# Altium schematic sheet LCD.SchDoc
size C
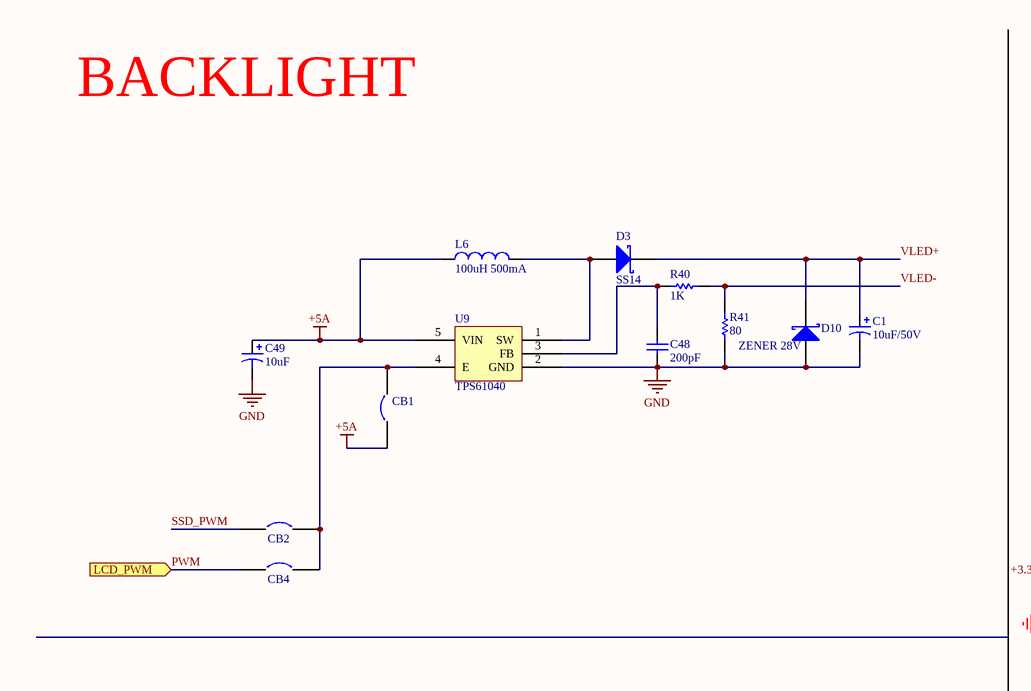
[diagram p0: LCD.SchDoc, left]
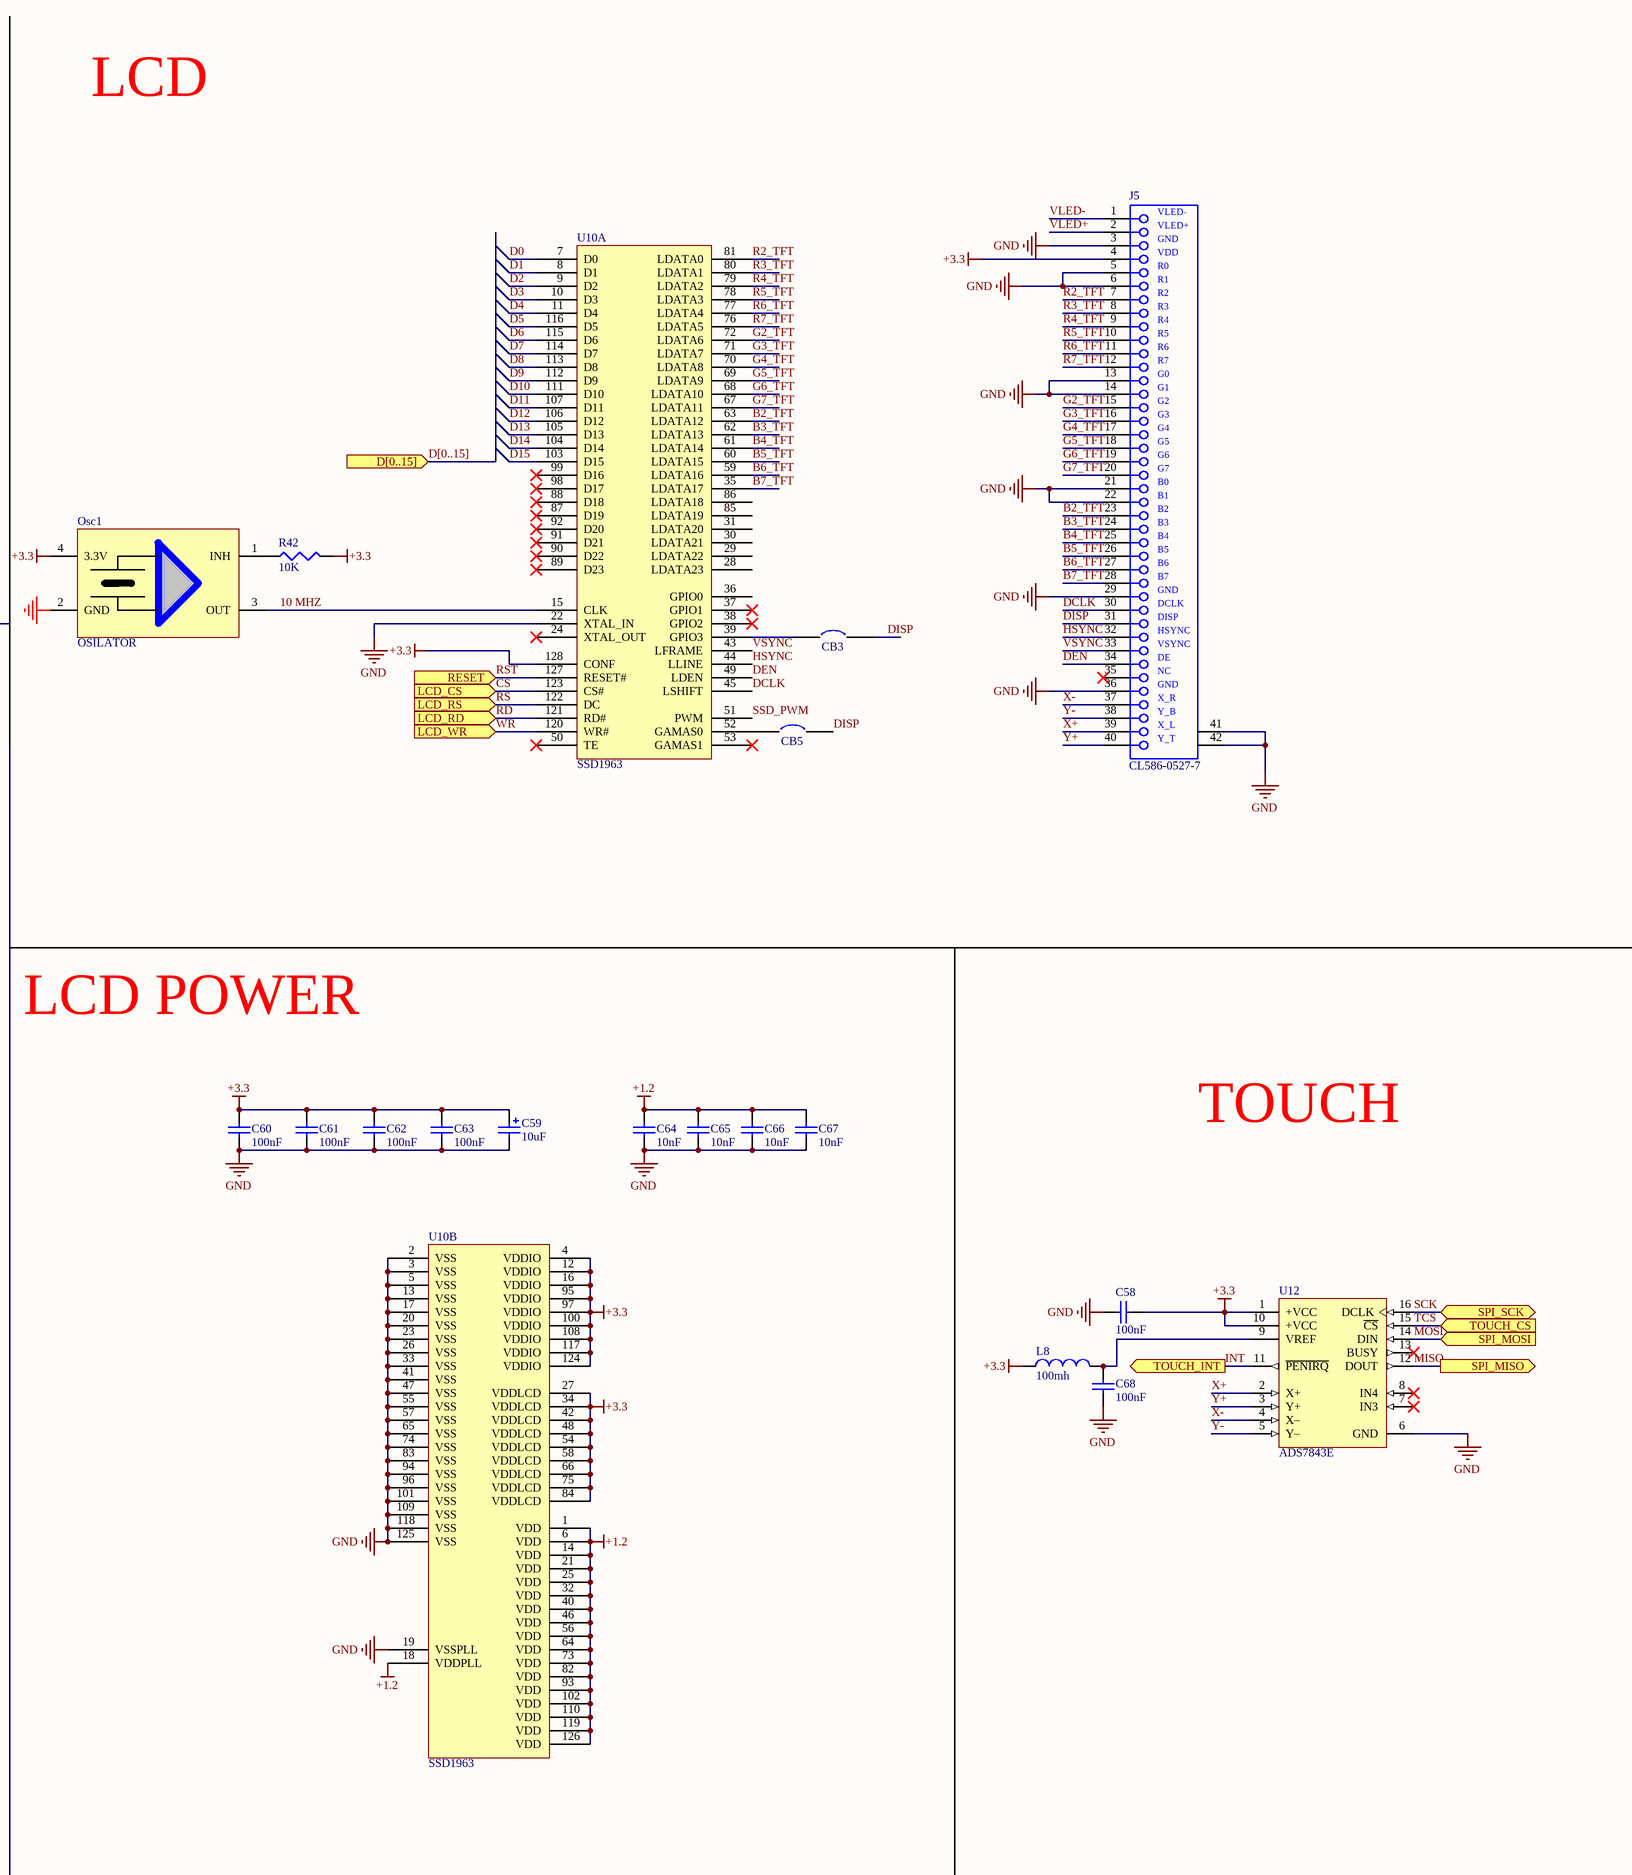
[diagram p1: LCD.SchDoc, right]

## Parts
C1  10uF/50V  [CAP1050]
C48  200pF  [1206]
C49  10uF  [CAP1016]
C58  100nF  [1206]
C59  10uF  [CAP1016]
C60  100nF  [0805]
C61  100nF  [0805]
C62  100nF  [0805]
C63  100nF  [0805]
C64  10nF  [0805]
C65  10nF  [0805]
C66  10nF  [0805]
C67  10nF  [0805]
C68  100nF  [1206]
CB1  JUMPER  [0805]  (value not drawn)
CB2  JUMPER  [0805]  (value not drawn)
CB3  JUMPER  [0805]  (value not drawn)
CB4  JUMPER  [0805]  (value not drawn)
CB5  JUMPER  [0805]  (value not drawn)
D3  SS14  [1N4007]
D10  ZENER 28V  [1N4007]
J5  CL586-0527-7  [FH40SB]
L6  100uH 500mA  [Inductorsmd]
L8  100mh  [L1206]
Osc1  OSILATOR  [XTAL_5X7]
R40  1K  [1206]
R41  80  [1206]
R42  10K  [1206]
U9  TPS61040  [SOT-23-5L]
U10  SSD1963  [LQFP128_M]  (parts A,B of 2)
U12  ADS7843E  [DBQ016]

## Ports
D[0..15] (in), LCD_CS (in), LCD_PWM (in), LCD_RD (in), LCD_RS (in), LCD_WR (in), RESET (in), SPI_MISO (out), SPI_MOSI (in), SPI_SCK (bidir), TOUCH_CS (in), TOUCH_INT (out)

## Nets
+1.2: C64.1 C65.1 C66.1 C67.1 U10.1(VDD) U10.6(VDD) U10.14(VDD) U10.18(VDDPLL) U10.21(VDD) U10.25(VDD) U10.32(VDD) U10.40(VDD) U10.46(VDD) U10.56(VDD) U10.64(VDD) U10.73(VDD) U10.82(VDD) U10.93(VDD) U10.102(VDD) U10.110(VDD) U10.119(VDD) U10.126(VDD)
+3.3: C58.2 C59.1 C60.1 C61.1 C62.1 C63.1 J5.4 L8.1 Osc1.4(3.3V) R42.2 U10.4(VDDIO) U10.12(VDDIO) U10.16(VDDIO) U10.27(VDDLCD) U10.34(VDDLCD) U10.42(VDDLCD) U10.48(VDDLCD) U10.54(VDDLCD) U10.58(VDDLCD) U10.66(VDDLCD) U10.75(VDDLCD) U10.84(VDDLCD) U10.95(VDDIO) U10.97(VDDIO) U10.100(VDDIO) U10.108(VDDIO) U10.117(VDDIO) U10.124(VDDIO) U10.128(CONF) U12.1(+VCC) U12.10(+VCC)
+5A: C49.1 CB1.1 L6.1 U9.5(VIN)
GND: C1.2 C48.1 C49.2 C58.1 C59.2 C60.2 C61.2 C62.2 C63.2 C64.2 C65.2 C66.2 C67.2 C68.1 D10.1(A) J5.3 J5.5 J5.6 J5.13 J5.14 J5.21 J5.22 J5.29 J5.36 J5.41(MH1) J5.42(MH2) Osc1.2(GND) R41.1 U9.2(GND) U10.2(VSS) U10.3(VSS) U10.5(VSS) U10.13(VSS) U10.17(VSS) U10.19(VSSPLL) U10.20(VSS) U10.22(XTAL_IN) U10.23(VSS) U10.26(VSS) U10.33(VSS) U10.41(VSS) U10.47(VSS) U10.55(VSS) U10.57(VSS) U10.65(VSS) U10.74(VSS) U10.83(VSS) U10.94(VSS) U10.96(VSS) U10.101(VSS) U10.109(VSS) U10.118(VSS) U10.125(VSS) U12.6(GND)
10 MHZ: Osc1.3(OUT) U10.15(CLK)
B2_TFT: J5.23 U10.63(LDATA12)
B3_TFT: J5.24 U10.62(LDATA13)
B4_TFT: J5.25 U10.61(LDATA14)
B5_TFT: J5.26 U10.60(LDATA15)
B6_TFT: J5.27 U10.59(LDATA16)
B7_TFT: J5.28 U10.35(LDATA17)
CS: U10.123(CS#) ; port LCD_CS
D0: U10.7(D0)
D1: U10.8(D1)
D2: U10.9(D2)
D3: U10.10(D3)
D4: U10.11(D4)
D5: U10.116(D5)
D6: U10.115(D6)
D7: U10.114(D7)
D8: U10.113(D8)
D9: U10.112(D9)
D10: U10.111(D10)
D11: U10.107(D11)
D12: U10.106(D12)
D13: U10.105(D13)
D14: U10.104(D14)
D15: U10.103(D15)
DCLK: J5.30 U10.45(LSHIFT)
DEN: J5.34 U10.49(LDEN)
DISP: CB3.2 CB5.2 J5.31
G2_TFT: J5.15 U10.72(LDATA6)
G3_TFT: J5.16 U10.71(LDATA7)
G4_TFT: J5.17 U10.70(LDATA8)
G5_TFT: J5.18 U10.69(LDATA9)
G6_TFT: J5.19 U10.68(LDATA10)
G7_TFT: J5.20 U10.67(LDATA11)
HSYNC: J5.32 U10.44(LLINE)
INT: U12.11(~{PENIRQ}) ; port TOUCH_INT
MISO: U12.12(DOUT) ; port SPI_MISO
MOSI: U12.14(DIN) ; port SPI_MOSI
PWM: CB4.1 ; port LCD_PWM
R2_TFT: J5.7 U10.81(LDATA0)
R3_TFT: J5.8 U10.80(LDATA1)
R4_TFT: J5.9 U10.79(LDATA2)
R5_TFT: J5.10 U10.78(LDATA3)
R6_TFT: J5.11 U10.77(LDATA4)
R7_TFT: J5.12 U10.76(LDATA5)
RD: U10.121(RD#) ; port LCD_RD
RS: U10.122(DC) ; port LCD_RS
RST: U10.127(RESET#) ; port RESET
SCK: U12.16(DCLK) ; port SPI_SCK
SSD_PWM: CB2.1 U10.51(PWM)
TCS: U12.15(~{CS}) ; port TOUCH_CS
VLED+: C1.1 D3.2(K) D10.2(K) J5.2
VLED-: J5.1 R40.2 R41.2
VSYNC: J5.33 U10.43(LFRAME)
WR: U10.120(WR#) ; port LCD_WR
X+: J5.39 U12.2(X+)
X-: J5.37 U12.4(X–)
Y+: J5.40 U12.3(Y+)
Y-: J5.38 U12.5(Y–)
NetC48_2: C48.2 R40.1 U9.3(FB)
NetC68_2: C68.2 L8.2 U12.9(VREF)
NetCB1_2: CB1.2 CB2.2 CB4.2 U9.4(E)
NetCB3_1: CB3.1 U10.39(GPIO3)
NetCB5_1: CB5.1 U10.52(GAMAS0)
NetD3_1: D3.1(A) L6.2 U9.1(SW)
NetOsc1_1: Osc1.1(INH) R42.1

Not connected (* = marked no-connect by the designer): J5 35*; U10 24(XTAL_OUT)* 28(LDATA23) 29(LDATA22) 30(LDATA21) 31(LDATA20) 36(GPIO0) 37(GPIO1)* 38(GPIO2)* 50(TE)* 53(GAMAS1)* 85(LDATA19) 86(LDATA18) 87(D19)* 88(D18)* 89(D23)* 90(D22)* 91(D21)* 92(D20)* 98(D17)* 99(D16)*; U12 7(IN3)* 8(IN4)* 13(BUSY)*

## Buses and harness runs
bus D[0..15] = port D[0..15]

## Notes on the sheet
- BACKLIGHT
- LCD
- LCD POWER
- TOUCH
- (in symbol CL586-0527-7) VLED-; VLED+; GND; VDD; R0; R1; R2; R3; R4; R5; R6; R7; G0; G1; G2; G3; G4; G5; G6; G7; B0; B1; B2; B3; B4; B5; B6; B7; DCLK; DISP; HSYNC; VSYNC; DE; NC; X_R; Y_B; X_L; Y_T

## Library data of the parts
C1 C49 = Cap Pol1: Polarized Capacitor (Radial); Value: 100pF; Published: 8-Jun-2000; LatestRevisionDate: 17-Jul-2002; LatestRevisionNote: Re-released for DXP Platform.; PackageReference: RB7.6-15; Publisher: Altium Limited
C48 = Cap Semi: Capacitor (Semiconductor SIM Model); Value: 100pF; Published: 8-Jun-2000; LatestRevisionDate: 29-May-2009; LatestRevisionNote: IPC-7351 Footprint Added.; PackageReference: C1206; Publisher: Altium Limited; PackageDescription: Chip Capacitor
C58 C60-C63 C68 = Cap: Capacitor; Published: 8-Jun-2000; Revision: July-2002: Re-released for DXP Platform.; Publisher: Altium Limited; Value: 100nF
C59 = Cap Pol1: Polarized Capacitor (Radial); Published: 8-Jun-2000; Revision: July-2002: Re-released for DXP Platform.; Publisher: Altium Limited; Value: 10uF
C64-C67 = Cap: Capacitor; Value: 100nF; Published: 8-Jun-2000; Revision: July-2002: Re-released for DXP Platform.; Publisher: Altium Limited
CB1-CB5 = Circuit Breaker: Published: 24-Mar-1999; LatestRevisionDate: 17-Jul-2002; LatestRevisionNote: Re-released for DXP Platform.; PackageReference: SPST-2; Publisher: Altium Limited
D3 D10 = D Schottky: Schottky Diode; Published: 8-Jun-2000; LatestRevisionDate: 17-Jul-2002; LatestRevisionNote: Re-released for DXP Platform.; PackageReference: SMB; Publisher: Altium Limited; Code_JEDEC: DO-214-AA
J5 = CL586-0527-7: FH12 Series, "Flip-Lock" SMT/ZIF FFC/FPC Connector - 0.5mm Spaced Bottom Contact; Positions: 40; ContactMaterial: Phosphor Bronze; Current: 0.4A; PCB_Layout: Complies with manufacturer's recommendation.; Published: 17-Jul-2002; DatasheetVersion: 13-Nov-2000; PackageVersion: 13-Nov-2000; PackageReference: FH12-40S-0.5SH; Publisher: Altium Limited; PadDimensions: Follow nominal values, Suitable for Wave Soldering, Adjust for Re-flow.; ComponentLink1Description: Manufacturer Link; ComponentLink1URL: http://www.hiroseusa.com/; ComponentLink2Description: Datasheet; ComponentLink2URL: http://www.hirose.co.jp/cataloge_hp/e58605370.pdf
L6 L8 = Inductor: Code_IEC: 1005; Value: 10mH; Published: 8-Jun-2000; LatestRevisionDate: 29-May-2009; LatestRevisionNote: IPC-7351 Footprint Added.; PackageReference: 0402-A; Publisher: Altium Limited; PackageDescription: Chip Inductor; Code_JEITA: 0402
R40 R41 = Res1: Resistor; Value: 10K; Published: 8-Jun-2000; LatestRevisionDate: 17-Jul-2002; LatestRevisionNote: Re-released for DXP Platform.; PackageReference: AXIAL-0.3; Publisher: Altium Limited
R42 = Res3: Resistor; Value: 1K; Published: 8-Jun-2000; LatestRevisionDate: 04-Mar-2005; LatestRevisionNote: PCB Footprint replaced.; PackageReference: J1-0603; Publisher: Altium Limited
U9 = TPS61040: Backlight Regulagtor
U12 = ADS7843E: 4-Wire Touch Screen Controller, 16-Pin SSOP, Pb-Free; Published: 6-Oct-2005; DatasheetVersion: May-2002; PackageVersion: Feb-2005; PackageReference: DBQ016; Publisher: Altium Limited; PackageDescription: SSOP; 16 Leads; Body Width 3.9 mm; Pitch 0.635 mm; Code_JEDEC: MO-137-AB; ComponentLink1Description: Manufacturer Link; ComponentLink1URL: http://focus.ti.com/docs/prod/folders/print/ads7843.html; ComponentLink2Description: Datasheet; ComponentLink2URL: http://focus.ti.com/lit/ds/symlink/ads7843.pdf